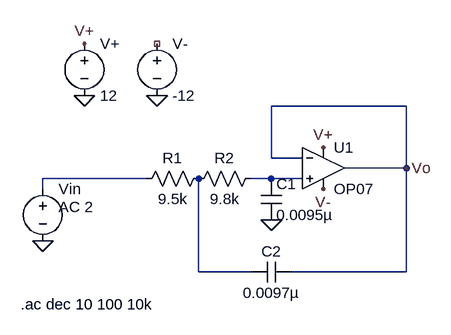
[diagram p0: schematic exp42.asc]
exp42.asc, the LTspice schematic file:
Version 4
SHEET 1 880 680
WIRE 416 64 208 64
WIRE 208 144 208 64
WIRE 256 144 208 144
WIRE 416 160 416 64
WIRE 416 160 320 160
WIRE 16 176 -144 176
WIRE 208 176 176 176
WIRE 256 176 208 176
WIRE -144 192 -144 176
WIRE 96 320 96 176
WIRE 176 320 96 320
WIRE 416 320 416 160
WIRE 416 320 240 320
FLAG -144 272 0
FLAG 208 240 0
FLAG -80 48 0
FLAG 32 48 0
FLAG 416 160 Vo
FLAG -80 -32 V+
FLAG 288 192 V-
FLAG 288 128 V+
SYMBOL voltage -144 176 R0
WINDOW 3 24 152 Left 2
WINDOW 123 24 44 Left 2
WINDOW 39 0 0 Left 0
SYMATTR Value ""
SYMATTR Value2 AC 2
SYMATTR InstName Vin
SYMBOL OpAmps\\OP07 288 96 R0
SYMATTR InstName U1
SYMBOL res 112 160 R90
WINDOW 0 0 56 VBottom 2
WINDOW 3 32 56 VTop 2
SYMATTR InstName R1
SYMATTR Value 9.5k
SYMBOL res 192 160 R90
WINDOW 0 0 56 VBottom 2
WINDOW 3 32 56 VTop 2
SYMATTR InstName R2
SYMATTR Value 9.8k
SYMBOL cap 192 176 R0
SYMATTR InstName C1
SYMATTR Value 0.0095µ
SYMBOL cap 240 304 R90
WINDOW 0 0 32 VBottom 2
WINDOW 3 32 32 VTop 2
SYMATTR InstName C2
SYMATTR Value 0.0097µ
SYMBOL voltage -80 -48 R0
SYMATTR InstName V+
SYMATTR Value 12
SYMBOL voltage 32 -48 R0
SYMATTR InstName V-
SYMATTR Value -12
TEXT -178 370 Left 2 !.ac dec 10 100 10k

The netlist it stands for:
* exp42.asc
Vin N001 0 AC 2
XU1 N002 Vo V+ V- Vo LT1001  ; OP07, pins In+ In- V+ V- OUT
R1 N003 N001 9.5k
R2 N002 N003 9.8k
C1 N002 0 0.0095µ
C2 Vo N003 0.0097µ
V+ V+ 0 12
V- NC_01 0 -12
.ac dec 10 100 10k
.lib LTC.lib
.backanno
.end